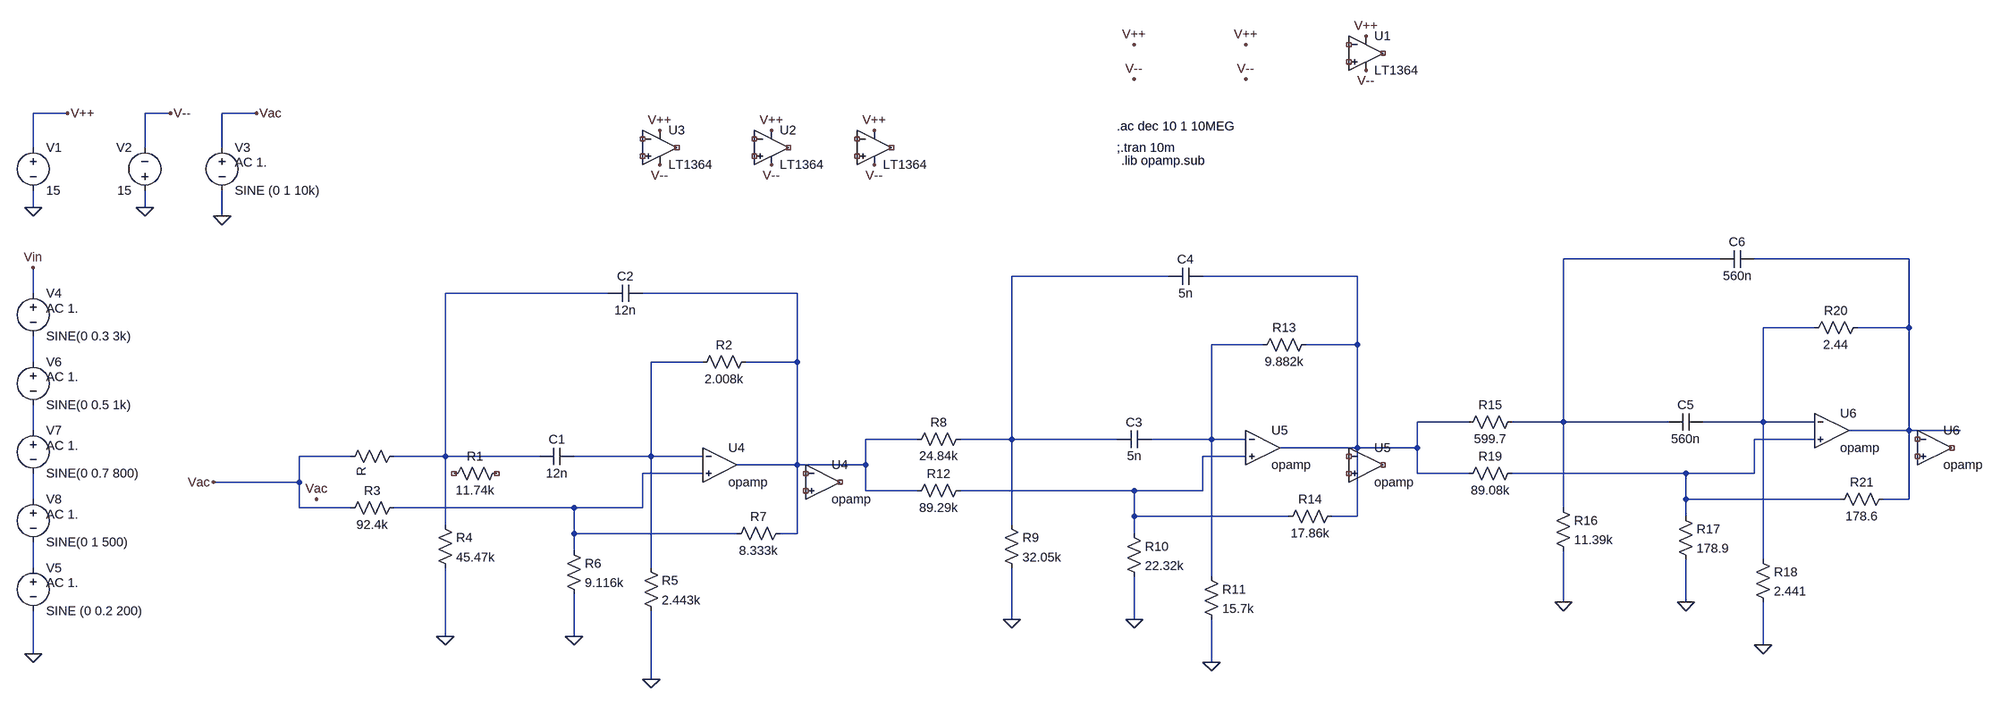
[diagram p0: schematic LT1634_Cauer_SK_1.asc]
LT1634_Cauer_SK_1.asc, the LTspice schematic file:
Version 4
SHEET 1 2532 692
WIRE -1216 -608 -1280 -608
WIRE -1024 -608 -1072 -608
WIRE -864 -608 -928 -608
WIRE -1280 -544 -1280 -608
WIRE -1072 -544 -1072 -608
WIRE -928 -544 -928 -608
WIRE -1280 -432 -1280 -464
WIRE -1072 -432 -1072 -464
WIRE -928 -416 -928 -464
WIRE 1888 -336 1584 -336
WIRE 2240 -336 1952 -336
WIRE 848 -304 544 -304
WIRE 1200 -304 912 -304
WIRE -1280 -272 -1280 -320
WIRE -208 -272 -512 -272
WIRE 144 -272 -144 -272
WIRE 2064 -208 1968 -208
WIRE 2240 -208 2240 -336
WIRE 2240 -208 2144 -208
WIRE 1024 -176 928 -176
WIRE 1200 -176 1200 -304
WIRE 1200 -176 1104 -176
WIRE -1280 -144 -1280 -192
WIRE -32 -144 -128 -144
WIRE 144 -144 144 -272
WIRE 144 -144 48 -144
WIRE 1408 -32 1312 -32
WIRE 1584 -32 1584 -336
WIRE 1584 -32 1488 -32
WIRE 1792 -32 1584 -32
WIRE 1968 -32 1968 -208
WIRE 1968 -32 1856 -32
WIRE 2064 -32 1968 -32
WIRE -1280 -16 -1280 -64
WIRE 2240 -16 2240 -208
WIRE 2240 -16 2128 -16
WIRE 2336 -16 2240 -16
WIRE 368 0 272 0
WIRE 544 0 544 -304
WIRE 544 0 448 0
WIRE 752 0 544 0
WIRE 928 0 928 -176
WIRE 928 0 816 0
WIRE 992 0 928 0
WIRE 2064 0 1952 0
WIRE 1200 16 1200 -176
WIRE 1200 16 1056 16
WIRE 1312 16 1312 -32
WIRE 1312 16 1200 16
WIRE -688 32 -784 32
WIRE -512 32 -512 -272
WIRE -512 32 -608 32
WIRE -336 32 -512 32
WIRE -128 32 -128 -144
WIRE -128 32 -272 32
WIRE -32 32 -128 32
WIRE 992 32 912 32
WIRE 144 48 144 -144
WIRE 144 48 32 48
WIRE 272 48 272 0
WIRE 272 48 144 48
WIRE -32 64 -144 64
WIRE 1312 64 1312 16
WIRE 1408 64 1312 64
WIRE 1824 64 1488 64
WIRE 1952 64 1952 0
WIRE 1952 64 1824 64
WIRE -784 80 -784 32
WIRE -784 80 -944 80
WIRE 272 96 272 48
WIRE 368 96 272 96
WIRE 784 96 448 96
WIRE 912 96 912 32
WIRE 912 96 784 96
WIRE -1280 112 -1280 64
WIRE 1824 112 1824 64
WIRE 2112 112 1824 112
WIRE 2240 112 2240 -16
WIRE 2240 112 2192 112
WIRE -784 128 -784 80
WIRE -688 128 -784 128
WIRE -272 128 -608 128
WIRE -144 128 -144 64
WIRE -144 128 -272 128
WIRE 1584 128 1584 -32
WIRE 784 144 784 96
WIRE 1072 144 784 144
WIRE 1200 144 1200 16
WIRE 1200 144 1152 144
WIRE 1824 144 1824 112
WIRE -512 160 -512 32
WIRE 544 160 544 0
WIRE -272 176 -272 128
WIRE 32 176 -272 176
WIRE 144 176 144 48
WIRE 144 176 112 176
WIRE 784 176 784 144
WIRE -272 208 -272 176
WIRE 1968 224 1968 -32
WIRE -1280 240 -1280 192
WIRE -128 240 -128 32
WIRE 928 256 928 0
WIRE 1584 304 1584 208
WIRE 1824 304 1824 224
WIRE 544 336 544 240
WIRE 784 336 784 256
WIRE -512 368 -512 240
WIRE -272 368 -272 288
WIRE 1968 384 1968 304
WIRE -1280 400 -1280 320
WIRE 928 416 928 336
WIRE -128 448 -128 320
FLAG -512 368 0
FLAG -272 368 0
FLAG -128 448 0
FLAG 544 336 0
FLAG 784 336 0
FLAG 928 416 0
FLAG 1584 304 0
FLAG 1824 304 0
FLAG 1968 384 0
FLAG -1280 -432 0
FLAG -1072 -432 0
FLAG -1216 -608 V++
FLAG -1024 -608 V--
FLAG -928 -416 0
FLAG -1280 -320 Vin
FLAG -864 -608 Vac
FLAG -1280 400 0
<<<<<<< HEAD
FLAG -944 80 Vac
FLAG 288 -512 V--
FLAG 288 -576 V++
FLAG 96 -512 V--
FLAG 96 -576 V++
FLAG -112 -512 V--
FLAG -112 -576 V++
SYMBOL res -592 16 R90
=======
FLAG -752 112 Vac
FLAG 1216 -688 V--
FLAG 1216 -752 V++
FLAG 992 -672 V--
FLAG 992 -736 V++
FLAG 784 -672 V--
FLAG 784 -736 V++
DATAFLAG 2480 16 ""
SYMBOL res -400 48 R90
>>>>>>> be1dafa317a8fb773b9f6f12f74a642e7cac8093
WINDOW 0 0 56 VBottom 2
WINDOW 3 32 56 VTop 2
SYMATTR InstName R1
SYMATTR Value 11.74k
SYMBOL cap -272 16 R90
WINDOW 0 0 32 VBottom 2
WINDOW 3 32 32 VTop 2
SYMATTR InstName C1
SYMATTR Value 12n
SYMBOL res -528 144 R0
SYMATTR InstName R4
SYMATTR Value 45.47k
SYMBOL res -288 192 R0
SYMATTR InstName R6
SYMATTR Value 9.116k
SYMBOL res -144 224 R0
SYMATTR InstName R5
SYMATTR Value 2.443k
SYMBOL cap -144 -288 R90
WINDOW 0 0 32 VBottom 2
WINDOW 3 32 32 VTop 2
SYMATTR InstName C2
SYMATTR Value 12n
SYMBOL res -592 112 R90
WINDOW 0 0 56 VBottom 2
WINDOW 3 32 56 VTop 2
SYMATTR InstName R3
SYMATTR Value 92.4k
SYMBOL res 64 -160 R90
WINDOW 0 0 56 VBottom 2
WINDOW 3 32 56 VTop 2
SYMATTR InstName R2
SYMATTR Value 2.008k
SYMBOL res 128 160 R90
WINDOW 0 0 56 VBottom 2
WINDOW 3 32 56 VTop 2
SYMATTR InstName R7
SYMATTR Value 8.333k
SYMBOL res 464 -16 R90
WINDOW 0 0 56 VBottom 2
WINDOW 3 32 56 VTop 2
SYMATTR InstName R8
SYMATTR Value 24.84k
SYMBOL cap 816 -16 R90
WINDOW 0 0 32 VBottom 2
WINDOW 3 32 32 VTop 2
SYMATTR InstName C3
SYMATTR Value 5n
SYMBOL res 528 144 R0
SYMATTR InstName R9
SYMATTR Value 32.05k
SYMBOL res 768 160 R0
SYMATTR InstName R10
SYMATTR Value 22.32k
SYMBOL res 912 240 R0
SYMATTR InstName R11
SYMATTR Value 15.7k
SYMBOL cap 912 -320 R90
WINDOW 0 0 32 VBottom 2
WINDOW 3 32 32 VTop 2
SYMATTR InstName C4
SYMATTR Value 5n
SYMBOL res 464 80 R90
WINDOW 0 0 56 VBottom 2
WINDOW 3 32 56 VTop 2
SYMATTR InstName R12
SYMATTR Value 89.29k
SYMBOL res 1120 -192 R90
WINDOW 0 0 56 VBottom 2
WINDOW 3 32 56 VTop 2
SYMATTR InstName R13
SYMATTR Value 9.882k
SYMBOL res 1168 128 R90
WINDOW 0 0 56 VBottom 2
WINDOW 3 32 56 VTop 2
SYMATTR InstName R14
SYMATTR Value 17.86k
SYMBOL res 1504 -48 R90
WINDOW 0 0 56 VBottom 2
WINDOW 3 32 56 VTop 2
SYMATTR InstName R15
SYMATTR Value 599.7
SYMBOL cap 1856 -48 R90
WINDOW 0 0 32 VBottom 2
WINDOW 3 32 32 VTop 2
SYMATTR InstName C5
SYMATTR Value 560n
SYMBOL res 1568 112 R0
SYMATTR InstName R16
SYMATTR Value 11.39k
SYMBOL res 1808 128 R0
SYMATTR InstName R17
SYMATTR Value 178.9
SYMBOL res 1952 208 R0
SYMATTR InstName R18
SYMATTR Value 2.441
SYMBOL cap 1952 -352 R90
WINDOW 0 0 32 VBottom 2
WINDOW 3 32 32 VTop 2
SYMATTR InstName C6
SYMATTR Value 560n
SYMBOL res 1504 48 R90
WINDOW 0 0 56 VBottom 2
WINDOW 3 32 56 VTop 2
SYMATTR InstName R19
SYMATTR Value 89.08k
SYMBOL res 2160 -224 R90
WINDOW 0 0 56 VBottom 2
WINDOW 3 32 56 VTop 2
SYMATTR InstName R20
SYMATTR Value 2.44
SYMBOL res 2208 96 R90
WINDOW 0 0 56 VBottom 2
WINDOW 3 32 56 VTop 2
SYMATTR InstName R21
SYMATTR Value 178.6
SYMBOL voltage -1280 -560 R0
WINDOW 123 0 0 Left 0
WINDOW 39 0 0 Left 0
SYMATTR InstName V1
SYMATTR Value 15
SYMBOL voltage -1072 -448 R180
WINDOW 0 24 96 Left 2
WINDOW 3 24 16 Left 2
SYMATTR InstName V2
SYMATTR Value 15
SYMBOL voltage -928 -560 R0
WINDOW 123 24 44 Left 2
WINDOW 39 0 0 Left 0
SYMATTR Value2 AC 1.
SYMATTR InstName V3
SYMATTR Value SINE (0 1 10k)
SYMBOL voltage -1280 -288 R0
WINDOW 123 24 44 Left 2
WINDOW 39 0 0 Left 0
SYMATTR Value2 AC 1.
SYMATTR InstName V4
SYMATTR Value SINE(0 0.3 3k)
SYMBOL voltage -1280 224 R0
WINDOW 123 24 44 Left 2
WINDOW 39 0 0 Left 0
SYMATTR Value2 AC 1.
SYMATTR InstName V5
SYMATTR Value SINE (0 0.2 200)
SYMBOL voltage -1280 -160 R0
WINDOW 123 24 44 Left 2
WINDOW 39 0 0 Left 0
SYMATTR Value2 AC 1.
SYMATTR InstName V6
SYMATTR Value SINE(0 0.5 1k)
SYMBOL voltage -1280 -32 R0
WINDOW 123 24 44 Left 2
WINDOW 39 0 0 Left 0
SYMATTR Value2 AC 1.
SYMATTR InstName V7
SYMATTR Value SINE(0 0.7 800)
SYMBOL voltage -1280 96 R0
WINDOW 123 24 44 Left 2
WINDOW 39 0 0 Left 0
SYMATTR Value2 AC 1.
SYMATTR InstName V8
SYMATTR Value SINE(0 1 500)
<<<<<<< HEAD
SYMBOL Opamps\\opamp 0 -16 R0
SYMATTR InstName U4
SYMBOL Opamps\\opamp 1024 -48 R0
SYMATTR InstName U5
SYMBOL Opamps\\opamp 2096 -80 R0
SYMATTR InstName U6
SYMBOL Opamps\\LT1364 288 -608 R0
=======
SYMBOL Opamps\\opamp 192 16 R0
SYMATTR InstName U4
SYMATTR SpiceLine2 GBW=1000Meg
SYMBOL Opamps\\opamp 1216 -16 R0
SYMATTR InstName U5
SYMATTR SpiceLine2 GBW=1000Meg
SYMBOL Opamps\\opamp 2288 -48 R0
SYMATTR InstName U6
SYMATTR SpiceLine2 GBW=1000Meg
SYMBOL Opamps\\LT1364 1216 -784 R0
>>>>>>> be1dafa317a8fb773b9f6f12f74a642e7cac8093
SYMATTR InstName U1
SYMBOL Opamps\\LT1364 96 -608 R0
SYMATTR InstName U2
SYMBOL Opamps\\LT1364 -112 -608 R0
SYMATTR InstName U3
TEXT 752 -584 Left 2 !.ac dec 10 1 10MEG
TEXT 752 -544 Left 2 !;.tran 10m
TEXT 760 -520 Left 2 !.lib opamp.sub

The netlist it stands for:
* LT1634_Cauer_SK_1.asc
R§? N005 Vac R
R1 NC_01 NC_02 11.74k
C1 N010 N005 12n
R4 N005 0 45.47k
R6 N014 0 9.116k
R5 N010 0 2.443k
C2 N006 N005 12n
R3 N014 Vac 92.4k
R2 N006 N010 2.008k
R7 N006 N014 8.333k
R8 N003 N006 24.84k
C3 N008 N003 5n
R9 N003 0 32.05k
R10 N013 0 22.32k
R11 N008 0 15.7k
C4 N004 N003 5n
R12 N013 N006 89.29k
R13 N004 N008 9.882k
R14 N004 N013 17.86k
R15 N001 N004 599.7
C5 N007 N001 560n
R16 N001 0 11.39k
R17 N012 0 178.9
R18 N007 0 2.441
C6 N002 N001 560n
R19 N012 N004 89.08k
R20 N002 N007 2.44
R21 N002 N012 178.6
V1 V++ 0 15
V2 0 V-- 15
V3 Vac 0 SINE (0 1 10k) AC 1.
V4 Vin N009 SINE(0 0.3 3k) AC 1.
V5 N016 0 SINE (0 0.2 200) AC 1.
V6 N009 N011 SINE(0 0.5 1k) AC 1.
V7 N011 N015 SINE(0 0.7 800) AC 1.
V8 N015 N016 SINE(0 1 500) AC 1.
XU4 N010 N014 N006 opamp Aol=100K GBW=10Meg  ; pins invin noninvin out
XU5 N008 N013 N004 opamp Aol=100K GBW=10Meg  ; pins invin noninvin out
XU6 N007 N012 N002 opamp Aol=100K GBW=10Meg  ; pins invin noninvin out
X? NC_03 NC_04 V++ V-- NC_05 LT1363  ; LT1364, pins In+ In- V+ V- OUT
XU4 NC_06 NC_07 NC_08 opamp Aol=100K GBW=1000Meg  ; pins invin noninvin out
XU5 NC_09 NC_10 NC_11 opamp Aol=100K GBW=1000Meg  ; pins invin noninvin out
XU6 NC_12 NC_13 NC_14 opamp Aol=100K GBW=1000Meg  ; pins invin noninvin out
XU1 NC_15 NC_16 V++ V-- NC_17 LT1363  ; LT1364, pins In+ In- V+ V- OUT
XU2 NC_18 NC_19 V++ V-- NC_20 LT1363  ; LT1364, pins In+ In- V+ V- OUT
XU3 NC_21 NC_22 V++ V-- NC_23 LT1363  ; LT1364, pins In+ In- V+ V- OUT
.ac dec 10 1 10MEG
;.tran 10m
.lib opamp.sub
.lib LTC.lib
.backanno
.end